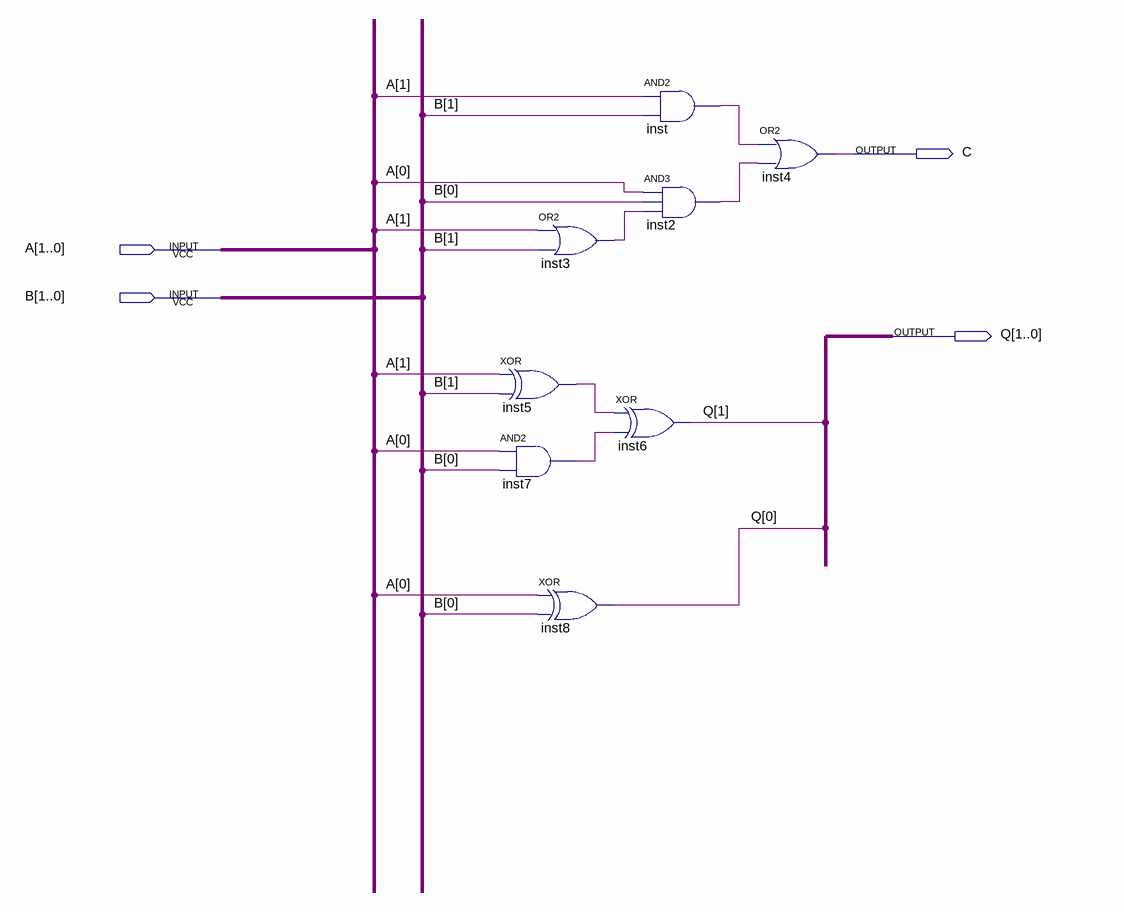
[diagram p0: schematic sheet]
// Quartus schematic Sumador2bits.bdf as structural Verilog: 8 symbols, 4 pins
module Sumador2bits (
  input  [1:0] A,
  input  [1:0] B,
  output C,
  output [1:0] Q
);

  wire inst2_out, inst3_out, inst5_out, inst7_out, inst_out;

  or inst3 (inst3_out, A[1], B[1]);
  xor inst5 (inst5_out, A[1], B[1]);
  and inst7 (inst7_out, A[0], B[0]);
  xor inst8 (Q[0], A[0], B[0]);
  xor inst6 (Q[1], inst5_out, inst7_out);
  and inst (inst_out, A[1], B[1]);
  and inst2 (inst2_out, A[0], B[0], inst3_out);
  or inst4 (C, inst_out, inst2_out);
endmodule
